# Altium schematic sheet SENSORS_XS.SchDoc: ESU - Sensors
size B; DrawnBy: M. Seago; Organization: Gravitas; Address1: Sponsored By:; Address2: Alan Morgan; Address3: Technical Advisor:; Address4: Dr. Joseph Morgan; Revision: 1A; SheetNumber: 2; SheetTotal: 3
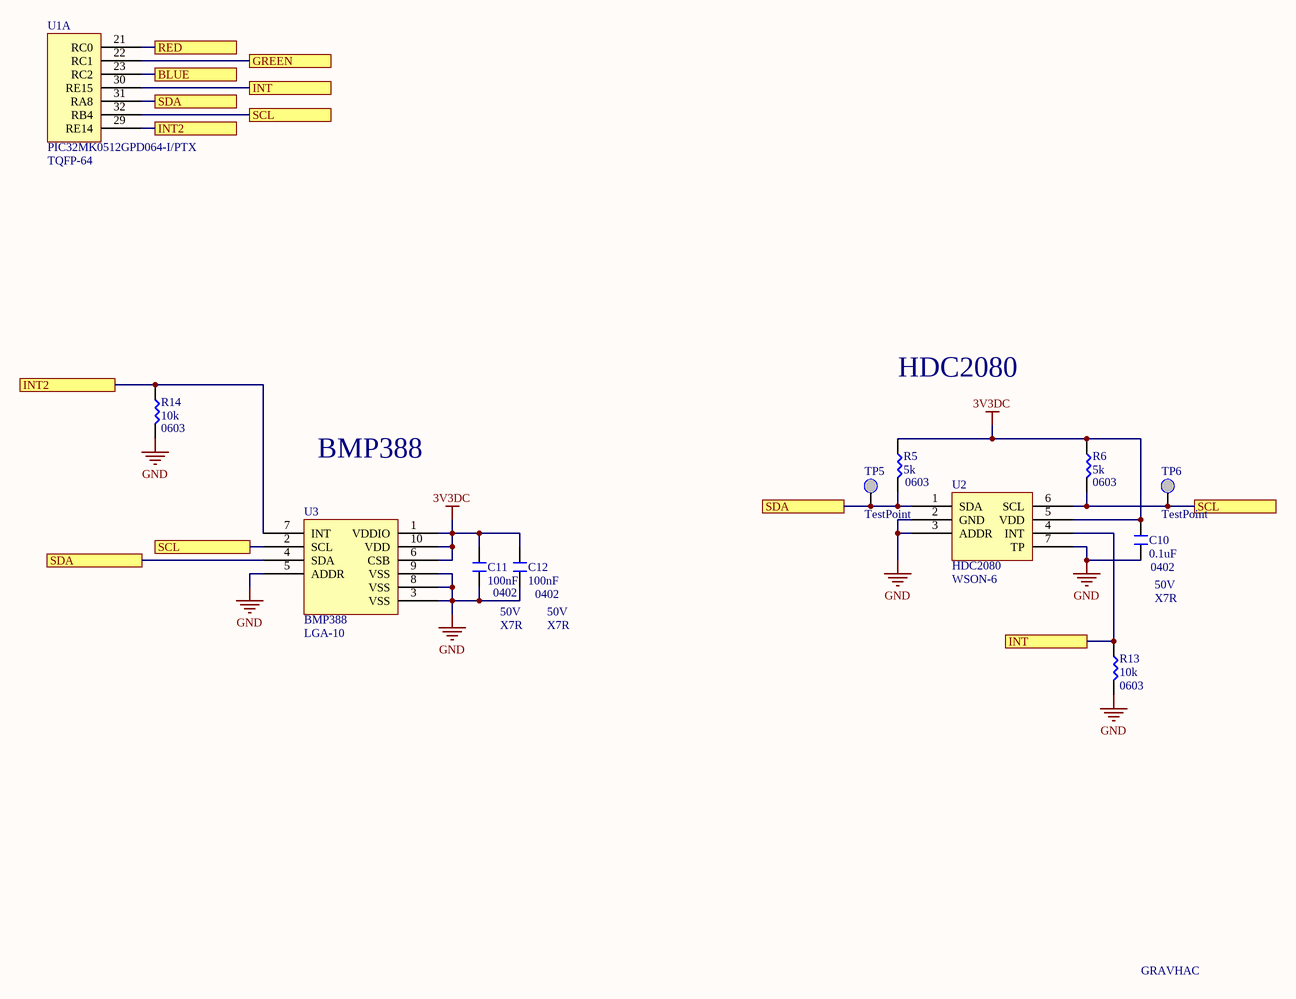
[diagram p0: SENSORS_XS.SchDoc]

## Parts
C10  0.1uF  [NonPolar-0402]
C11  100nF  [NonPolar-0402]
C12  100nF  [NonPolar-0402]
R5  5k  [NonPolar-0603]
R6  5k  [NonPolar-0603]
R13  10k  [NonPolar-0603]
R14  10k  [NonPolar-0603]
TP5  TestPoint  [TP - S2751-46R]
TP6  TestPoint  [TP - S2751-46R]
U1  PIC32MK0512GPD064-I/PTX  [PIC32MK0512GPD064]  (part A of 3)
U2  HDC2080  [HDC2080]
U3  BMP388  [BMP388]

## Ports
BLUE, GREEN, INT, INT2, RED, SCL, SDA

## Nets
3V3DC: C10.2 C11.2 C12.2 R5.2 R6.2 U2.5(VDD) U3.1(VDDIO) U3.6(CSB) U3.10(VDD)
GND: C10.1 C11.1 C12.1 R13.1 R14.1 U2.2(GND) U2.3(ADDR) U2.7(TP) U3.3(VSS) U3.5(ADDR) U3.8(VSS) U3.9(VSS)
BLUE: U1.23(RC2) ; port BLUE
GREEN: U1.22(RC1) ; port GREEN
INT: R13.2 U1.30(RE15) U2.4(INT) ; port INT
INT2: R14.2 U1.29(RE14) U3.7(INT) ; port INT2
RED: U1.21(RC0) ; port RED
SCL: R6.1 TP6.1 U1.32(RB4) U2.6(SCL) U3.2(SCL) ; port SCL
SDA: R5.1 TP5.1 U1.31(RA8) U2.1(SDA) U3.4(SDA) ; port SDA

## Notes on the sheet
- (near U1) TQFP-64
- HDC2080
- (near R14) 0603
- BMP388
- (near R5) 0603
- (near R6) 0603
- (near U2) WSON-6
- (near C10) 0402
- (near C10) 50V
- (near U3) LGA-10
- 0402
- 50V
- X7R
- (near C12) 0402
- (near C12) 50V
- (near R13) 0603
- GRAVHAC
- Title
- Size:
- Date:
- B
- Drawn By:
- Revision:
- Sheet
- of
- File:

## Library data of the parts
C10-C12 = Cap - 0402
R5 R6 R13 R14 = Res - 0603
TP5 TP6 = TestPoint: S2751-46R